# Altium schematic sheet BEESP_CODE_esp32.SchDoc
size A4
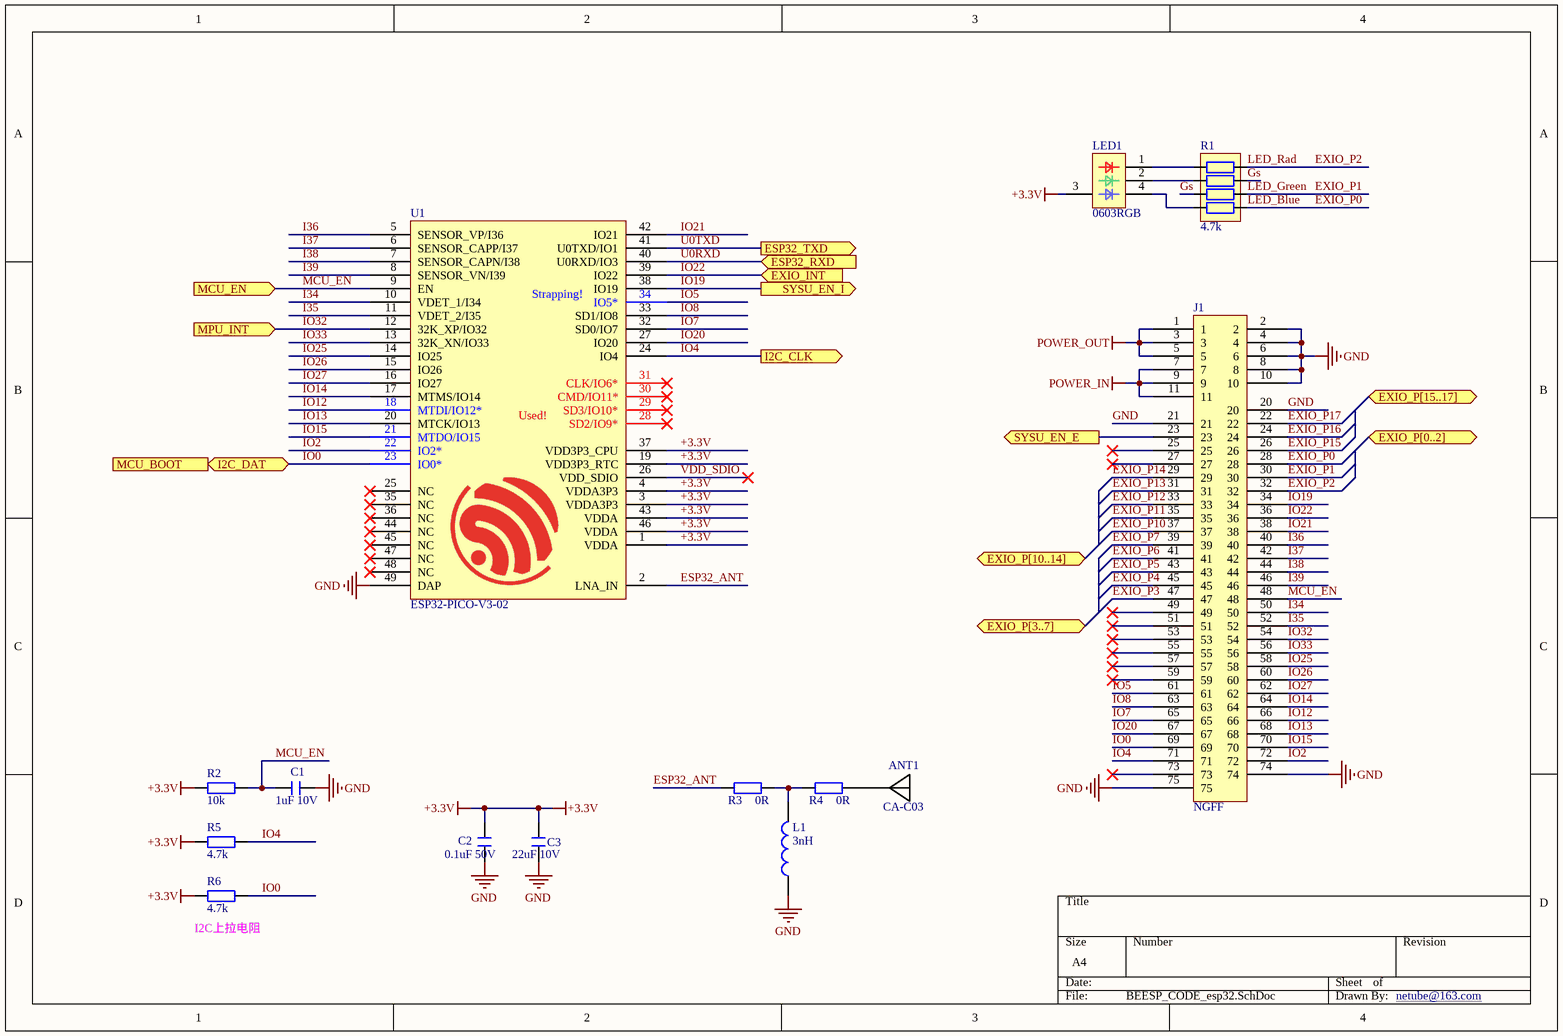
[diagram p0: BEESP_CODE_esp32.SchDoc]

## Parts
ANT1  CA-C03  [CA-C03]
C1  1uF 10V  [C 0402_L]
C2  0.1uF 50V  [C 0402_L]
C3  22uF 10V  [C 0603_L]
J1  NGFF  [NGFF_BKey_5+6_PCB]
L1  3nH  [R 0402_L]
LED1  0603RGB  [0603RGB]
R1  4.7k  [RCA-8P4R-0402]
R2  10k  [R 0402_L]
R3  0R  [R 0402_L]
R4  0R  [R 0402_L]
R5  4.7k  [R 0402_L]
R6  4.7k  [R 0402_L]
U1  ESP32-PICO-V3-02  [QFN48 7X7_N]

## Ports
ESP32_RXD (in), ESP32_TXD (out), EXIO_INT (in), EXIO_P[0..2] (bidir), EXIO_P[3..7] (bidir), EXIO_P[10..14] (bidir), EXIO_P[15..17] (bidir), I2C_CLK (out), I2C_DAT (bidir), MCU_BOOT (in), MCU_EN (in), MPU_INT (in), SYSU_EN_E (out), SYSU_EN_I (out)

## Nets
+3.3V: C2.2 C3.1 LED1.3(VCC) R2.2 R5.2 R6.2 U1.1(VDDA) U1.3(VDDA3P3) U1.4(VDDA3P3) U1.19(VDD3P3_RTC) U1.37(VDD3P3_CPU) U1.43(VDDA) U1.46(VDDA)
GND: C1.1 C2.1 C3.2 J1.2 J1.4 J1.6 J1.8 J1.10 J1.20 J1.21 J1.74 J1.75 L1.1 U1.49(DAP)
POWER_IN: J1.7 J1.9 J1.11
POWER_OUT: J1.1 J1.3 J1.5
ESP32_ANT: R3.1 U1.2(LNA_IN)
EXIO_P0: J1.28 R1.5  [also labelled LED_Blue]
EXIO_P1: J1.30 R1.6  [also labelled LED_Green]
EXIO_P2: J1.32 R1.8  [also labelled LED_Rad]
EXIO_P3: J1.47
EXIO_P4: J1.45
EXIO_P5: J1.43
EXIO_P6: J1.41
EXIO_P7: J1.39
EXIO_P10: J1.37
EXIO_P11: J1.35
EXIO_P12: J1.33
EXIO_P13: J1.31
EXIO_P14: J1.29
EXIO_P15: J1.26
EXIO_P16: J1.24
EXIO_P17: J1.22
Gs: R1.3 R1.7
I34: J1.50 U1.10(VDET_1/I34)
I35: J1.52 U1.11(VDET_2/I35)
I36: J1.40 U1.5(SENSOR_VP/I36)
I37: J1.42 U1.6(SENSOR_CAPP/I37)
I38: J1.44 U1.7(SENSOR_CAPN/I38)
I39: J1.46 U1.8(SENSOR_VN/I39)
IO0: J1.69 R6.1 U1.23(IO0*) ; port I2C_DAT, port MCU_BOOT
IO2: J1.72 U1.22(IO2*)
IO4: J1.71 R5.1 U1.24(IO4) ; port I2C_CLK
IO5: J1.61 U1.34(IO5*)
IO7: J1.65 U1.32(SD0/IO7)
IO8: J1.63 U1.33(SD1/IO8)
IO12: J1.66 U1.18(MTDI/IO12*)
IO13: J1.68 U1.20(MTCK/IO13)
IO14: J1.64 U1.17(MTMS/IO14)
IO15: J1.70 U1.21(MTDO/IO15)
IO19: J1.34 U1.38(IO19) ; port SYSU_EN_I
IO20: J1.67 U1.27(IO20)
IO21: J1.38 U1.42(IO21)
IO22: J1.36 U1.39(IO22) ; port EXIO_INT
IO25: J1.58 U1.14(IO25)
IO26: J1.60 U1.15(IO26)
IO27: J1.62 U1.16(IO27)
IO32: J1.54 U1.12(32K_XP/IO32) ; port MPU_INT
IO33: J1.56 U1.13(32K_XN/IO33)
MCU_EN: C1.2 J1.48 R2.1 U1.9(EN) ; port MCU_EN
SYSU_EN_E: J1.23 ; port SYSU_EN_E
U0RXD: U1.40(U0RXD/IO3) ; port ESP32_RXD
U0TXD: U1.41(U0TXD/IO1) ; port ESP32_TXD
VDD_SDIO: U1.26(VDD_SDIO)
NetANT1_1: ANT1.1 R4.2
NetL1_2: L1.2 R3.2 R4.1
NetLED1_1: LED1.1(R) R1.1
NetLED1_2: LED1.2(G) R1.2
NetLED1_4: LED1.4(B) R1.4

Not connected (* = marked no-connect by the designer): J1 25* 27* 49* 51* 53* 55* 57* 59* 73*; U1 25(NC)* 28(SD2/IO9*)* 29(SD3/IO10*)* 30(CMD/IO11*)* 31(CLK/IO6*)* 35(NC)* 36(NC)* 44(NC)* 45(NC)* 47(NC)* 48(NC)*

## Notes on the sheet
- (near R6) I2C上拉电阻
- netube@163.com
- (in symbol ESP32-PICO-V3-02) Strapping!; Used!

## Library data of the parts
ANT1 = ANT1: PCB板载天线; 版权归属: 封装库来自淘宝 ID：黄晶宝石; BOM名称: PCB板载天线; 技术支持，联系售后: https://shop463601444.taobao.com
C1-C3 = C: 贴片电容; BOM名称: 无极性贴片电容; 优秀评价可免费更新: 联系淘宝ID：黄晶宝石，获取更新版封装库; 卖家免费技术支持，联系售后: 唯一出售店铺网址https://shop463601444.taobao.com; 本封装库来自淘宝卖家 ID：黄晶宝石: 其他店铺购入均为盗版，请立即申请退款
J1 = NGFF_BKey_5+6_PCB
L1 = L: 小功率贴片电感; 优秀评价可免费更新: 联系淘宝ID：黄晶宝石，获取更新版封装库; 卖家免费技术支持，联系售后: 唯一出售店铺网址https://shop463601444.taobao.com; 本封装库来自淘宝卖家 ID：黄晶宝石: 其他店铺购入均为盗版，请立即申请退款; BOM名称: 小功率贴片电感
R1 = R-8P4R: 贴片排阻; BOM名称: 贴片网络排阻; 优秀评价可免费更新: 联系淘宝ID：黄晶宝石，获取更新版封装库; 卖家免费技术支持，联系售后: 唯一出售店铺网址https://shop463601444.taobao.com; 本封装库来自淘宝卖家 ID：黄晶宝石: 其他店铺购入均为盗版，请立即申请退款
R2-R6 = R: 贴片电阻; 优秀评价可免费更新: 联系淘宝ID：黄晶宝石，获取更新版封装库; 卖家免费技术支持，联系售后: 唯一出售店铺网址https://shop463601444.taobao.com; 本封装库来自淘宝卖家 ID：黄晶宝石: 其他店铺购入均为盗版，请立即申请退款; BOM名称: 贴片电阻